# Altium schematic sheet PuenteR.SchDoc
size A4; SheetNumber: 2; SheetTotal: 13
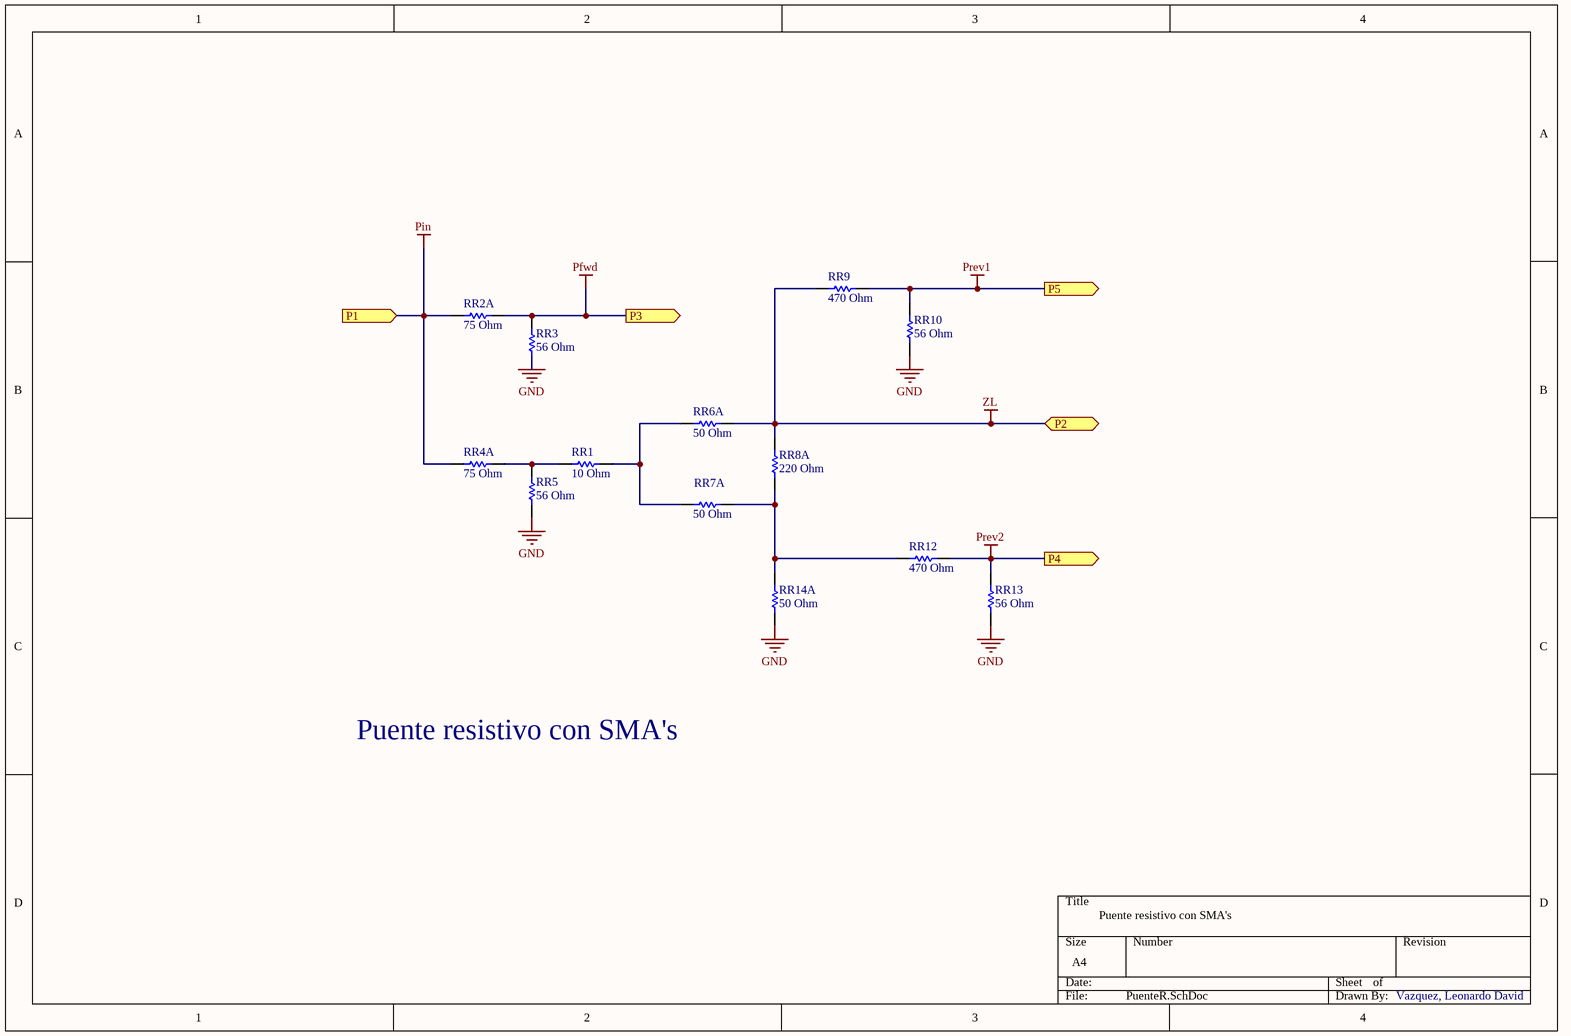
[diagram p0: PuenteR.SchDoc]

## Parts
RR1  10 Ohm  [RESC2013X60X40ML20T25]
RR2A  75 Ohm  [RESC2013X60X40ML20T25]
RR3  56 Ohm  [RESC2013X60X40ML20T25]
RR4A  75 Ohm  [RESC2013X60X40ML20T25]
RR5  56 Ohm  [RESC2013X60X40ML20T25]
RR6A  50 Ohm  [RESC2013X60X40ML20T25]
RR7A  50 Ohm  [RESC2013X60X40ML20T25]
RR8A  220 Ohm  [RESC2013X60X40ML20T25]
RR9  470 Ohm  [RESC2013X60X40ML20T25]
RR10  56 Ohm  [RESC2013X60X40ML20T25]
RR12  470 Ohm  [RESC2013X60X40ML20T25]
RR13  56 Ohm  [RESC2013X60X40ML20T25]
RR14A  50 Ohm  [RESC2013X60X40ML20T25]

## Ports
P1 (in), P2 (bidir), P3 (out), P4 (out), P5 (out)

## Nets
GND: RR3.2 RR5.2 RR10.2 RR13.2 RR14A.2
Pfwd: RR2A.1 RR3.1 ; port P3
Pin: RR2A.2 RR4A.2 ; port P1
Prev1: RR9.1 RR10.1 ; port P5
Prev2: RR12.1 RR13.1 ; port P4
ZL: RR6A.1 RR8A.1 RR9.2 ; port P2
NetRR1_1: RR1.1 RR4A.1 RR5.1
NetRR1_2: RR1.2 RR6A.2 RR7A.2
NetRR7A_1: RR7A.1 RR8A.2 RR12.2 RR14A.1

## Notes on the sheet
- Puente resistivo con SMA's
- Vazquez, Leonardo David

## Library data of the parts
RR1 RR2A RR3 RR4A RR5 RR6A RR7A RR8A RR9 RR10 RR12 RR13 RR14A = CMP-2001-00580-1: Manufacturer: Panasonic; Part Number: ERA6AEB101V